# Altium schematic sheet Keypad_Temp_BatLevel.SchDoc
size A4; SheetNumber: 4; SheetTotal: 7
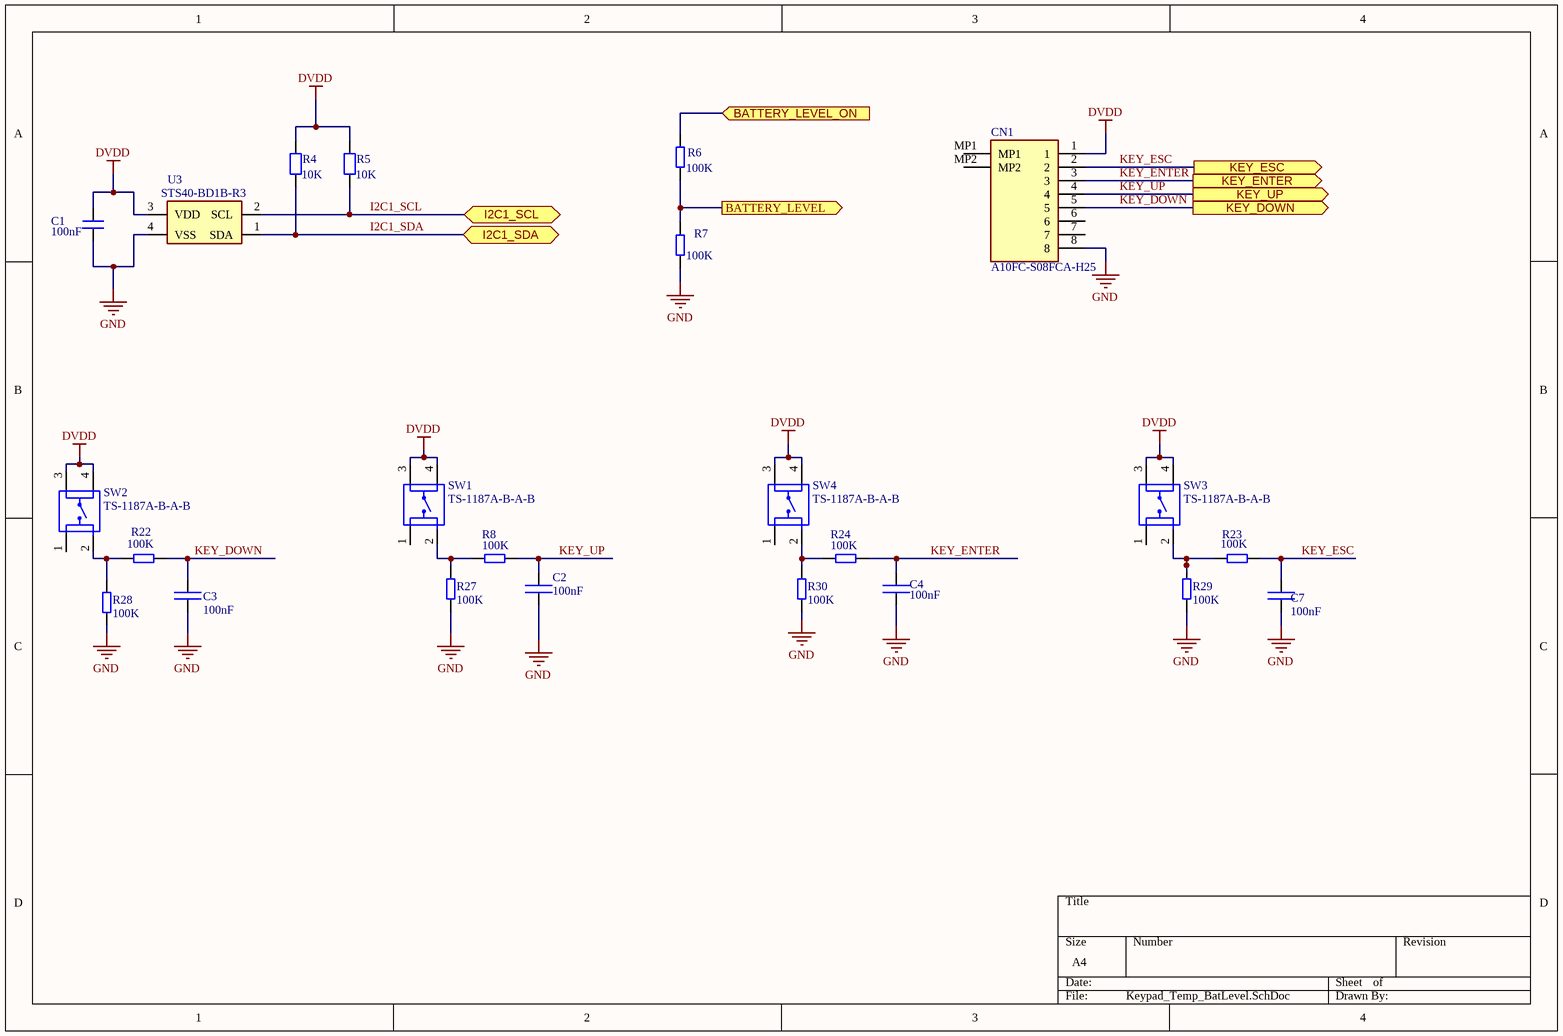
[diagram p0: Keypad_Temp_BatLevel.SchDoc]

## Parts
C1  100nF  [CAP_SM0603_YAGEOCC2_N]
C2  100nF  [CAP_SM0603_YAGEOCC2_N]
C3  100nF  [CAP_SM0603_YAGEOCC2_N]
C4  100nF  [CAP_SM0603_YAGEOCC2_N]
C7  100nF  [CAP_SM0603_YAGEOCC2_N]
CN1  A10FC-S08FCA-H25  [849528]
R4  10K  [RES_SM0603_YAGEORC_N]
R5  10K  [RES_SM0603_YAGEORC_N]
R6  100K  [RES_SM0603_YAGEORC_N]
R7  100K  [RES_SM0603_YAGEORC_N]
R8  100K  [RES_SM0603_YAGEORC_N]
R22  100K  [RES_SM0603_YAGEORC_N]
R23  100K  [RES_SM0603_YAGEORC_N]
R24  100K  [RES_SM0603_YAGEORC_N]
R27  100K  [RES_SM0603_YAGEORC_N]
R28  100K  [RES_SM0603_YAGEORC_N]
R29  100K  [RES_SM0603_YAGEORC_N]
R30  100K  [RES_SM0603_YAGEORC_N]
SW1  TS-1187A-B-A-B  [TS-1187A-B-A-B]
SW2  TS-1187A-B-A-B  [TS-1187A-B-A-B]
SW3  TS-1187A-B-A-B  [TS-1187A-B-A-B]
SW4  TS-1187A-B-A-B  [TS-1187A-B-A-B]
U3  STS40-BD1B-R3  [STS40BD1BR3]

## Ports
BATTERY_LEVEL (out), BATTERY_LEVEL_ON (in), I2C1_SCL (bidir), I2C1_SDA (bidir), KEY_DOWN (out), KEY_ENTER (out), KEY_ESC (out), KEY_UP (out)

## Nets
DVDD: C1.2 CN1.1 R4.2 R5.2 SW1.3(g) SW1.4 SW2.3(g) SW2.4 SW3.3(g) SW3.4 SW4.3(g) SW4.4 U3.3(VDD)
GND: C1.1 C2.2 C3.1 C4.2 C7.2 CN1.8 R7.1 R27.1 R28.1 R29.1 R30.1 U3.4(VSS)
BATTERY_LEVEL: R6.1 R7.2 ; port BATTERY_LEVEL
BATTERY_LEVEL_ON: R6.2 ; port BATTERY_LEVEL_ON
I2C1_SCL: R5.1 U3.2(SCL) ; port I2C1_SCL
I2C1_SDA: R4.1 U3.1(SDA) ; port I2C1_SDA
KEY_DOWN: C3.2 CN1.5 R22.2 ; port KEY_DOWN
KEY_ENTER: C4.1 CN1.3 R24.2 ; port KEY_ENTER
KEY_ESC: C7.1 CN1.2 R23.2 ; port KEY_ESC
KEY_UP: C2.1 CN1.4 R8.2 ; port KEY_UP
NetR8_1: R8.1 R27.2 SW1.2
NetR22_1: R22.1 R28.2 SW2.2
NetR23_1: R23.1 R29.2 SW3.2
NetR24_1: R24.1 R30.2 SW4.2

Not connected (* = marked no-connect by the designer): CN1 6 7 MP1 MP2; SW1 1; SW2 1; SW3 1; SW4 1

## Library data of the parts
C1-C4 C7 = CC0603KRX7R9BB104: CAP 100nF SM0603 X7R 50V YAGEO CC2; Tolerance (%): 10; Voltage Rating (Volts): 50; Category: Capacitor; Manufacturer: Yageo; Manufacturer Part Number: CC0603KRX7R9BB104; Package: 0603; Value: 100nF; Supplier Part Number 1: 1362556; Supplier 1: Farnell; ComponentLink1URL: http://www.yageo.com; ComponentLink1Description: Manufacturer Website; Supplier 2: Digi-Key; Supplier Part Number 2: 311-1344-1-ND; Datasheet: https://datasheet.lcsc.com/lcsc/2211101700_YAGEO-CC0603KRX7R9BB104_C14663.pdf
CN1 = A10FC-S08FCA-H25: FFC/FPC Connector 8 Position 1mm Pitch Bottom Contact Surface Mount, Right Angle -40℃~+85℃; Manufacturer: JXTCONN; Vendor Part Number: C42447839; Vendor: LCSC; Manufacturer Part Number: A10FC-S08FCA-H25; Price: 0.089
R4 R5 = RC0603FR-0710KL: RES 10K SM0603 YAGEO RC_L; Power (Watts): 0.1; Resistance (Ohms): 10000; Tolerance (%): 1; Category: Resistor; Manufacturer: Yageo; Manufacturer Part Number: RC0603FR-0710KL; Package: 0603; Value: 10K; Supplier Part Number 1: 9238603; Supplier 1: Farnell; ComponentLink1Description: Manufacturer Website; ComponentLink1URL: http://www.yageo.com; Supplier 2: Digi-Key; Supplier Part Number 2: 311-10.0KHRCT-ND
R6-R8 R22-R24 R27-R30 = RC0603FR-13100KL: RES 100K SM0603 YAGEO RC_L; Power (Watts): 0.1; Resistance (Ohms): 100000; Tolerance (%): 1; Category: Resistor; Manufacturer: Yageo; Manufacturer Part Number: RC0603FR-13100KL; Package: 0603; Value: 100K; Supplier Part Number 1: 2309107; Supplier 1: Farnell; ComponentLink1Description: Manufacturer Website; ComponentLink1URL: http://www.yageo.com; Supplier 2: Digi-Key
SW1-SW4 = TS-1187A-B-A-B: Switch tactile SMD; Manufacturer: XKB Connectivity; Vendor Part Number: C318884; Vendor: LCSC; Manufacturer Part Number: TS-1187A-B-A-B
U3 = STS40-BD1B-R3: Board Mount Temperature Sensors Base Accuracy Version, I2C Address 0x45; Manufacturer: Sensirion; Manufacturer Part Number: STS40-BD1B-R3